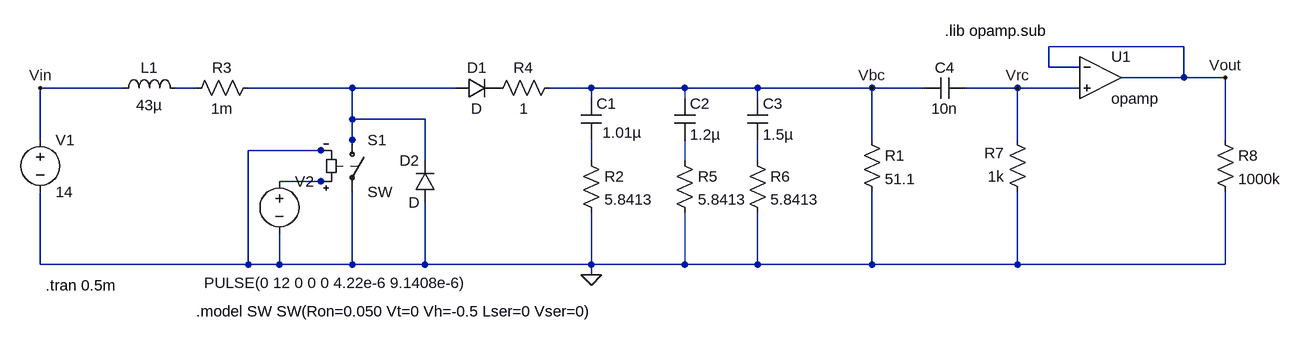
[diagram p0: schematic DC-DC Boost Converter with Opamp.asc]
DC-DC Boost Converter with Opamp.asc, the LTspice schematic file:
Version 4
SHEET 1 1880 680
WIRE 1696 -352 1488 -352
WIRE 1488 -320 1488 -352
WIRE 1536 -320 1488 -320
WIRE 1696 -304 1696 -352
WIRE 1696 -304 1600 -304
WIRE 1760 -304 1696 -304
WIRE 64 -288 -64 -288
WIRE 176 -288 144 -288
WIRE 416 -288 256 -288
WIRE 576 -288 416 -288
WIRE 784 -288 720 -288
WIRE 928 -288 784 -288
WIRE 1040 -288 928 -288
WIRE 1216 -288 1040 -288
WIRE 1296 -288 1216 -288
WIRE 1440 -288 1360 -288
WIRE 1536 -288 1440 -288
WIRE 784 -272 784 -288
WIRE 928 -272 928 -288
WIRE 1040 -272 1040 -288
WIRE 416 -240 416 -288
WIRE 528 -240 416 -240
WIRE -64 -208 -64 -288
WIRE 416 -208 416 -240
WIRE 1216 -208 1216 -288
WIRE 1440 -208 1440 -288
WIRE 1760 -208 1760 -304
WIRE 368 -192 256 -192
WIRE 384 -192 368 -192
WIRE 416 -192 416 -208
WIRE 528 -176 528 -240
WIRE 784 -176 784 -208
WIRE 928 -176 928 -208
WIRE 1040 -176 1040 -208
WIRE 368 -144 304 -144
WIRE 384 -144 368 -144
WIRE -64 -16 -64 -128
WIRE 256 -16 256 -192
WIRE 256 -16 -64 -16
WIRE 304 -16 304 -64
WIRE 304 -16 256 -16
WIRE 416 -16 416 -128
WIRE 416 -16 304 -16
WIRE 528 -16 528 -112
WIRE 528 -16 416 -16
WIRE 784 -16 784 -96
WIRE 784 -16 528 -16
WIRE 928 -16 928 -96
WIRE 928 -16 784 -16
WIRE 1040 -16 1040 -96
WIRE 1040 -16 928 -16
WIRE 1216 -16 1216 -128
WIRE 1216 -16 1040 -16
WIRE 1440 -16 1440 -128
WIRE 1440 -16 1216 -16
WIRE 1760 -16 1760 -128
WIRE 1760 -16 1440 -16
WIRE 784 0 784 -16
FLAG 784 0 0
FLAG -64 -288 Vin
FLAG 1216 -288 Vbc
FLAG 1440 -288 Vrc
FLAG 1760 -304 Vout
SYMBOL voltage -64 -224 R0
WINDOW 123 0 0 Left 2
WINDOW 39 0 0 Left 2
SYMATTR InstName V1
SYMATTR Value 14
SYMBOL voltage 304 -160 R0
WINDOW 123 0 0 Left 2
WINDOW 39 0 0 Left 2
WINDOW 3 -116 172 Left 2
SYMATTR Value PULSE(0 12 0 0 0 4.22e-6 9.1408e-6)
SYMATTR InstName V2
SYMBOL ind 48 -272 R270
WINDOW 0 32 56 VTop 2
WINDOW 3 5 56 VBottom 2
SYMATTR InstName L1
SYMATTR Value 43µ
SYMBOL res 1200 -224 R0
SYMATTR InstName R1
SYMATTR Value 51.1
SYMBOL cap 768 -272 R0
WINDOW 3 33 53 Left 2
SYMATTR Value 1.01µ
SYMATTR InstName C1
SYMBOL sw 416 -224 R0
SYMATTR InstName S1
SYMBOL diode 544 -112 R180
WINDOW 0 24 64 Left 2
WINDOW 3 24 0 Left 2
SYMATTR InstName D2
SYMBOL res 768 -192 R0
SYMATTR InstName R2
SYMATTR Value 5.8413
SYMBOL diode 576 -272 R270
WINDOW 0 32 32 VTop 2
WINDOW 3 0 32 VBottom 2
SYMATTR InstName D1
SYMBOL res 272 -304 R90
WINDOW 0 0 56 VBottom 2
WINDOW 3 32 56 VTop 2
SYMATTR InstName R3
SYMATTR Value 1m
SYMBOL res 736 -304 R90
WINDOW 0 0 56 VBottom 2
WINDOW 3 32 56 VTop 2
SYMATTR InstName R4
SYMATTR Value 1
SYMBOL cap 912 -272 R0
SYMATTR InstName C2
SYMATTR Value 1.2µ
SYMBOL cap 1024 -272 R0
SYMATTR InstName C3
SYMATTR Value 1.5µ
SYMBOL res 912 -192 R0
SYMATTR InstName R5
SYMATTR Value 5.8413
SYMBOL res 1024 -192 R0
SYMATTR InstName R6
SYMATTR Value 5.8413
SYMBOL res 1456 -112 R180
WINDOW 0 36 76 Left 2
WINDOW 3 36 40 Left 2
SYMATTR InstName R7
SYMATTR Value 1k
SYMBOL cap 1360 -304 R90
WINDOW 0 0 32 VBottom 2
WINDOW 3 32 32 VTop 2
SYMATTR InstName C4
SYMATTR Value 10n
SYMBOL Opamps\\opamp 1568 -368 R0
SYMATTR InstName U1
SYMBOL res 1744 -224 R0
SYMATTR InstName R8
SYMATTR Value 1000k
TEXT 176 56 Left 2 !.model SW SW(Ron=0.050 Vt=0 Vh=-0.5 Lser=0 Vser=0)
TEXT -56 16 Left 2 !.tran 0.5m
TEXT 1328 -376 Left 2 !.lib opamp.sub

The netlist it stands for:
* DC-DC Boost Converter with Opamp.asc
V1 Vin 0 14
V2 N006 0 PULSE(0 12 0 0 0 4.22e-6 9.1408e-6)
L1 Vin N001 43µ
R1 Vbc 0 51.1
C1 Vbc N003 1.01µ
S1 N002 0 N006 0 SW
D2 0 N002 D
R2 N003 0 5.8413
D1 N002 P001 D
R3 N002 N001 1m
R4 Vbc P001 1
C2 Vbc N004 1.2µ
C3 Vbc N005 1.5µ
R5 N004 0 5.8413
R6 N005 0 5.8413
R7 0 Vrc 1k
C4 Vrc Vbc 10n
XU1 Vout Vrc Vout opamp Aol=100K GBW=10Meg  ; pins invin noninvin out
R8 Vout 0 1000k
.model D D
.lib standard.dio
.model SW SW(Ron=0.050 Vt=0 Vh=-0.5 Lser=0 Vser=0)
.tran 0.5m
.lib opamp.sub
.backanno
.end